# Altium schematic sheet 06-JTAG.SchDoc
size A4; DocumentNumber: 13; SheetNumber: 13; SheetTotal: 34
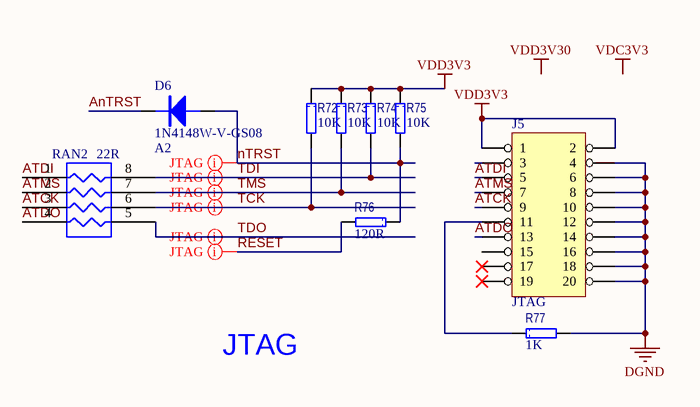
[diagram p0: 06-JTAG.SchDoc]

## Parts
D6  1N4148W-V-GS08  value A2  [SOD123]
J5  JTAG  [IDC20S]
R72  value 10K  [1608[0603]R]  (hidden comment: CRCW060310K0FKEA)
R73  value 10K  [1608[0603]R]  (hidden comment: CRCW060310K0FKEA)
R74  value 10K  [1608[0603]R]  (hidden comment: CRCW060310K0FKEA)
R75  value 10K  [1608[0603]R]  (hidden comment: CRCW060310K0FKEA)
R76  value 120R  [1608[0603]R]  (hidden comment: CRCW0603120RFKEA)
R77  value 1K  [1608[0603]R]  (hidden comment: CRCW06031K00FKEA)
RAN2  value 22R  [R-AR4]  (hidden comment: CRA06S08322R0JTA)

## Nets
DGND: J5.4 J5.6 J5.8 J5.10 J5.12 J5.14 J5.16 J5.18 J5.20 R77.2
VDD3V3: J5.1 J5.2 R72.1 R73.1 R74.1 R75.1
AnTRST: D6.2(K)
ATCK: J5.9 RAN2.3(R3)
ATDI: J5.5 RAN2.1(R1)
ATDO: J5.13 RAN2.4(R4)
ATMS: J5.7 RAN2.2(R2)
nTRST: D6.1(A) R75.2 R76.1
RESET: R76.2
TCK: R72.2 RAN2.6(R3)
TDI: R74.2 RAN2.8(R1)
TDO: RAN2.5(R4)
TMS: R73.2 RAN2.7(R2)
NetJ5_11: J5.11 R77.1

Not connected (* = marked no-connect by the designer): J5 3 15 17* 19*

## Layout directives
net class JTAG: nTRST, RESET, TCK, TDI, TDO, TMS

## Notes on the sheet
- JTAG
- Labels drawn without touching a wire or pin: VDC3V3, VDD3V30

## Library data of the parts
D6 = 1N4148W: 二极管 - 通用，功率，开关 100V Io/150mA; Manufacturer: Vishay Semiconductors; 配置: Single; 工作温度范围: - 65 C to + 150 C; 封装 / 箱体: SOD-123; 封装: Reel; 产品: Switching Diodes; 正向连续电流: 0.15 A; 最大浪涌电流: 0.5 A; 安装风格: SMD/SMT; 恢复时间: 4 ns; 正向电压下降: 1.2 V; 制造商: Vishay; 最大二极管电容: 4 pF; 最大工作温度: + 150 C; 最大功率耗散: 350 mW; 最大反向漏泄电流: 5 uA; 最小工作温度: - 65 C; 标准包装数量: 15000; Supplier 1: Mouser; Supplier Part Number 1: 625-1N4148W-V; Manufacturer Part Number: 1N4148W-V-GS08; RoHS: RoHS Compliant; Category: 二极管 - 通用，功率，开关; Stock 1: 404148; Pricing 1: 1=0.090, 10=0.083, 50=0.072, 100=0.068, 500=0.032, 1000=0.026, 3000=0.021, 9000=0.016, 10000=0.016, 18000=0.014 (USD); 峰值反向电压: 100 V; 产品种类: Switching Diodes; RoHS - 贸泽: Y; Minimum Order Quantity: 1; Reeling: True; ComponentLink1URL: http://www.mouser.com/ds/2/427/1n4148w--240387.pdf; ComponentLink1Description: http://www.mouser.com/ds/2/427/1n4148w--240387.pdf; Description 1: 二极管 - 通用，功率，开关 100V Io/150mA
J5 = HEADER 10X2: 插针 CON
R72-R75 = RES: 厚膜电阻器 - SMD 1/10watt 10Kohms 1%; Manufacturer: Vishay / Dale; 尺寸: 0.85 mm W x 1.55 mm L x 0.45 mm H; 工作温度范围: - 55 C to + 155 C; 封装 / 箱体: 0603 (1608 metric); 封装: Reel; 功率额定值: 100 mW; 产品: Thick Film Resistors SMD; 系列: CRCW; 温度系数: 100 PPM / K; 端接类型: SMD/SMT; 电压额定值: 75 V; 制造商: Vishay; 产品种类: 0603 Thick Film Chip Resistors; 标准包装数量: 5000; 外壳代码 - in: 0603; 外壳代码 - mm: 1608; Supplier 1: Mouser; Supplier Part Number 1: 71-CRCW0603-10K-E3; Manufacturer Part Number: CRCW060310K0FKEA; RoHS: RoHS Compliant By Exemption; Category: 厚膜电阻器 - SMD; Stock 1: 0; Pricing 1: 1=0.080, 10=0.013, 100=0.010, 1000=0.008, 5000=0.005, 25000=0.004, 50000=0.003 (USD); 电阻: 10 kOhms; 容差: 1 %; RoHS - 贸泽: E; Minimum Order Quantity: 1; Reeling: True; ComponentLink1URL: http://www.mouser.com/ds/2/427/dcrcwe3-109170.pdf; ComponentLink1Description: http://www.mouser.com/ds/2/427/dcrcwe3-109170.pdf; Description 1: 厚膜电阻器 - SMD 1/10watt 10Kohms 1%
R76 = RES: 厚膜电阻器 - SMD 1/10watt 120ohms 1%; Manufacturer: Vishay / Dale; 尺寸: 0.85 mm W x 1.55 mm L x 0.45 mm H; 工作温度范围: - 55 C to + 155 C; 封装 / 箱体: 0603 (1608 metric); 封装: Reel; 功率额定值: 100 mW; 产品: Thick Film Resistors SMD; 系列: CRCW; 温度系数: 100 PPM / K; 端接类型: SMD/SMT; 电压额定值: 75 V; 外壳代码 - in: 0603; 外壳代码 - mm: 1608; 制造商: Vishay; 产品种类: 0603 Thick Film Chip Resistors; 标准包装数量: 5000; Supplier 1: Mouser; Supplier Part Number 1: 71-CRCW0603-120-E3; Manufacturer Part Number: CRCW0603120RFKEA; RoHS: RoHS Compliant By Exemption; Category: 厚膜电阻器 - SMD; Stock 1: 11148; Pricing 1: 1=0.080, 10=0.013, 100=0.010, 1000=0.008, 5000=0.005, 25000=0.004, 50000=0.003 (USD); 电阻: 120 Ohms; 容差: 1 %; RoHS - 贸泽: E; Minimum Order Quantity: 1; Reeling: True; ComponentLink1URL: http://www.mouser.com/ds/2/427/dcrcwe3-109170.pdf; ComponentLink1Description: http://www.mouser.com/ds/2/427/dcrcwe3-109170.pdf; Description 1: 厚膜电阻器 - SMD 1/10watt 120ohms 1%
R77 = RES: 厚膜电阻器 - SMD 1/10watt 1.0Kohms 1%; Manufacturer: Vishay / Dale; 尺寸: 0.85 mm W x 1.55 mm L x 0.45 mm H; 工作温度范围: - 55 C to + 155 C; 封装 / 箱体: 0603 (1608 metric); 封装: Reel; 功率额定值: 100 mW; 产品: Thick Film Resistors SMD; 电阻: 1 kOhms; 系列: CRCW; 温度系数: 100 PPM / K; 端接类型: SMD/SMT; 电压额定值: 75 V; 制造商: Vishay; 产品种类: 0603 Thick Film Chip Resistors; 标准包装数量: 5000; 外壳代码 - in: 0603; 外壳代码 - mm: 1608; Supplier 1: Mouser; Supplier Part Number 1: 71-CRCW0603-1.0K-E3; Manufacturer Part Number: CRCW06031K00FKEA; RoHS: RoHS Compliant By Exemption; Category: 厚膜电阻器 - SMD; Stock 1: 276938; Pricing 1: 1=0.080, 10=0.013, 100=0.010, 1000=0.008, 5000=0.005, 25000=0.004, 50000=0.003 (USD); 容差: 1 %; RoHS - 贸泽: E; Minimum Order Quantity: 1; Reeling: True; ComponentLink1URL: http://www.mouser.com/ds/2/427/dcrcwe3-109170.pdf; ComponentLink1Description: http://www.mouser.com/ds/2/427/dcrcwe3-109170.pdf; Description 1: 厚膜电阻器 - SMD 1/10watt 1.0Kohms 1%
RAN2 = RP4R: 电阻器网络与阵列 8Term 22ohms 5% Convex; Manufacturer: Vishay / Dale; 尺寸: 1.5 mm W x 1.6 mm L x 0.5 mm H; 工作温度范围: - 55 C to + 150 C; 封装: Reel; 系列: CRA06; 温度系数: 200 PPM / K; 端接类型: SMD/SMT; 电路类型: Isolated; 管脚数量: 8; 电阻器数量: 4; 引线间隔: 0.8 mm; 制造商: Vishay; 产品种类: Thick Film Resistor Arrays; 产品类型: Arrays; Supplier 1: Mouser; Supplier Part Number 1: 71-CRA06S08322R0JTA; Manufacturer Part Number: CRA06S08322R0JTA; RoHS: RoHS Compliant By Exemption; Description 1: 电阻器网络与阵列 8Term 22ohms 5% Convex; Category: 电阻器网络与阵列; Stock 1: 1674; Pricing 1: 1=0.090, 100=0.080, 500=0.070, 1000=0.056, 5000=0.051, 10000=0.050, 25000=0.044 (USD); 容差: 5 %; 电阻数值: 22 Ohms; RoHS - 贸泽: E; Minimum Order Quantity: 1; Reeling: True; ComponentLink1URL: http://www.mouser.com/ds/2/427/cra06es-73101.pdf; ComponentLink1Description: http://www.mouser.com/ds/2/427/cra06es-73101.pdf